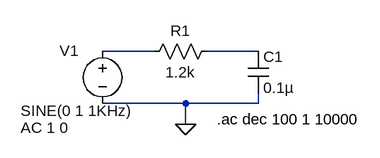
[diagram p0: schematic LowPass.asc]
LowPass.asc, the LTspice schematic file:
Version 4
SHEET 1 880 680
WIRE 160 112 80 112
WIRE 320 112 240 112
WIRE 208 192 80 192
WIRE 320 192 320 176
WIRE 320 192 208 192
WIRE 208 224 208 192
FLAG 208 224 0
SYMBOL res 256 96 R90
WINDOW 0 0 56 VBottom 2
WINDOW 3 32 56 VTop 2
SYMATTR InstName R1
SYMATTR Value 1.2k
SYMBOL cap 304 112 R0
SYMATTR InstName C1
SYMATTR Value 0.1µ
SYMBOL voltage 80 96 R0
WINDOW 0 -66 15 Left 2
WINDOW 3 -126 107 Left 2
WINDOW 123 -126 133 Left 2
WINDOW 39 0 0 Left 0
SYMATTR InstName V1
SYMATTR Value SINE(0 1 1KHz)
SYMATTR Value2 AC 1 0
TEXT 256 216 Left 2 !.ac dec 100 1 10000

The netlist it stands for:
* LowPass.asc
R1 N002 N001 1.2k
C1 N002 0 0.1µ
V1 N001 0 SINE(0 1 1KHz) AC 1 0
.ac dec 100 1 10000
.backanno
.end